# Altium schematic sheet cpu.SchDoc
size A3
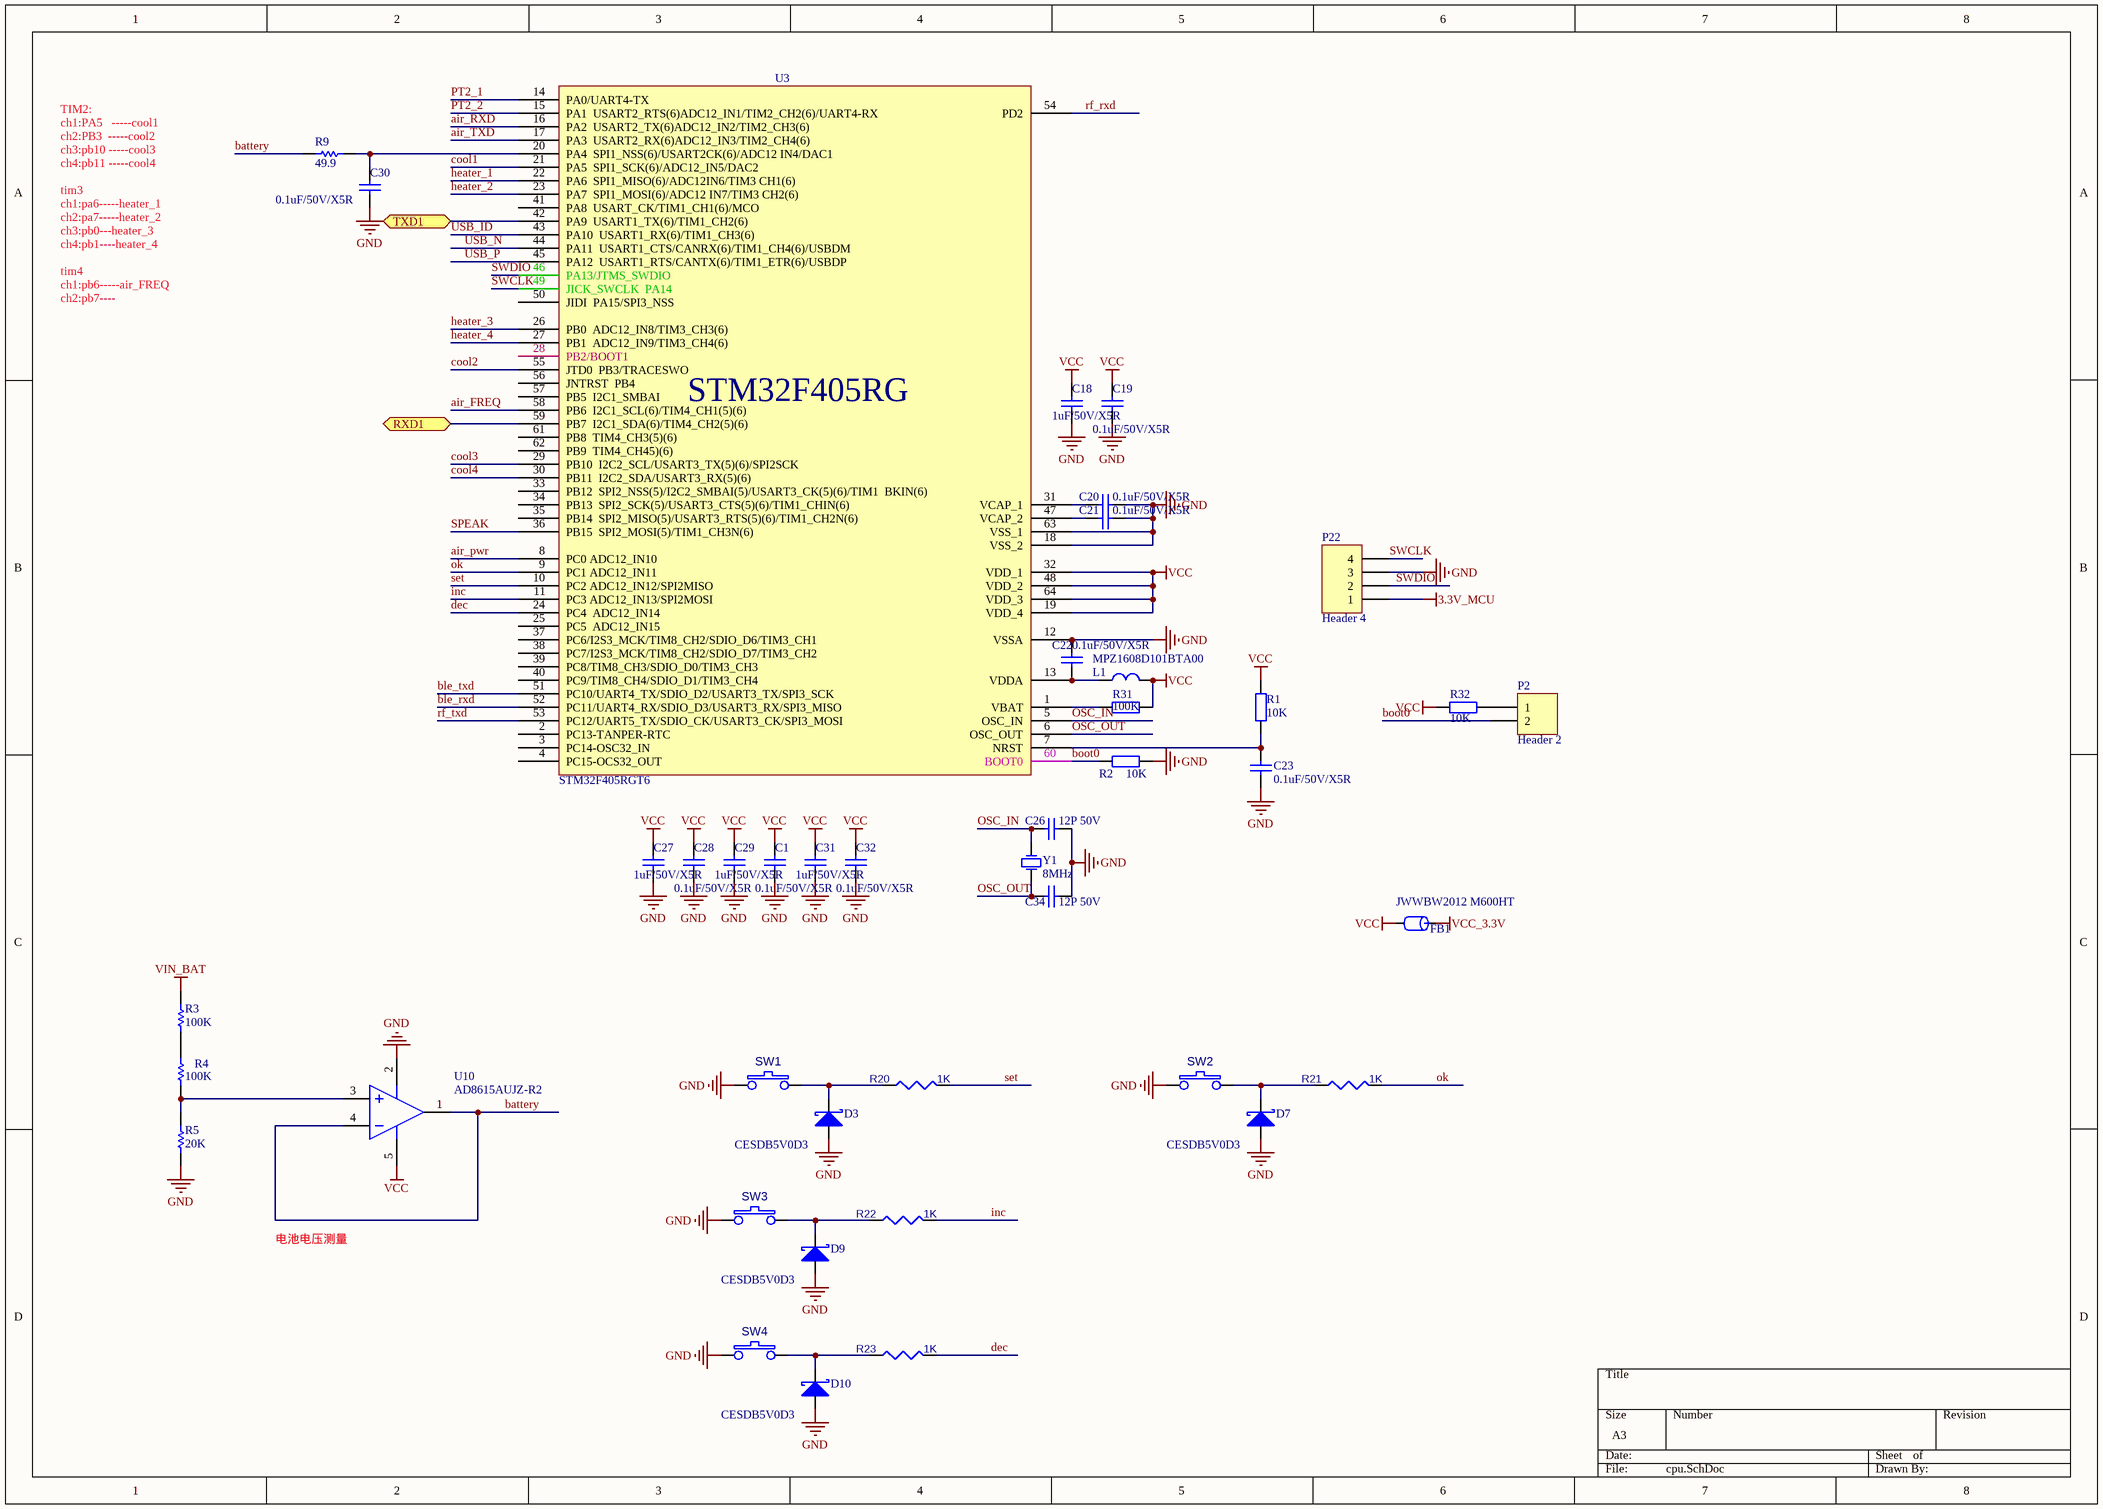
[diagram p0: cpu.SchDoc]

## Parts
C1  0.1uF/50V/X5R  [0603C]
C18  1uF/50V/X5R  [0603C]
C19  0.1uF/50V/X5R  [0603C]
C20  0.1uF/50V/X5R  [0603C]
C21  0.1uF/50V/X5R  [0603C]
C22  0.1uF/50V/X5R  [0603C]
C23  0.1uF/50V/X5R  [0603C]
C26  12P 50V  [0603C]
C27  1uF/50V/X5R  [0603C]
C28  0.1uF/50V/X5R  [0603C]
C29  1uF/50V/X5R  [0603C]
C30  0.1uF/50V/X5R  [0603C]
C31  1uF/50V/X5R  [0603C]
C32  0.1uF/50V/X5R  [0603C]
C34  12P 50V  [0603C]
D3  CESDB5V0D3  [SOD323]
D7  CESDB5V0D3  [SOD323]
D9  CESDB5V0D3  [SOD323]
D10  CESDB5V0D3  [SOD323]
FB1  JWWBW2012 M600HT  [0805CZ]
L1  MPZ1608D101BTA00  [0603R]
P2  Header 2  [HDR1X2]
P22  Header 4  [HDR1X4]
R1  10K  [0603R]
R2  10K  [0603R]
R3  100K  [0603R]
R4  100K  [0603R]
R5  20K  [0603R]
R9  49.9  [0603R]
R20  value 1K  [0603R]  (hidden comment: 1k/1%)
R21  value 1K  [0603R]  (hidden comment: 1k/1%)
R22  value 1K  [0603R]  (hidden comment: 1k/1%)
R23  value 1K  [0603R]  (hidden comment: 1k/1%)
R31  100K  [0603R]
R32  10K  [0603R]
SW1  SW PUSHBUTTON  [SW-SMD_L3.9-W3.0-P4.45]  (value not drawn)
SW2  SW PUSHBUTTON  [SW-SMD_L3.9-W3.0-P4.45]  (value not drawn)
SW3  SW PUSHBUTTON  [SW-SMD_L3.9-W3.0-P4.45]  (value not drawn)
SW4  SW PUSHBUTTON  [SW-SMD_L3.9-W3.0-P4.45]  (value not drawn)
U3  STM32F405RGT6  [LQFP-64]
U10  AD8615AUJZ-R2  [sot-23-5]
Y1  8MHz  [CRAY_5032]

## Ports
RXD1 (bidir), TXD1 (bidir)

## Nets
3.3V_MCU: P22.1
GND: C1.1 C18.1 C19.1 C20.1 C21.1 C22.1 C23.1 C26.1 C27.1 C28.1 C29.1 C30.1 C31.1 C32.1 C34.1 D3.1(A) D7.1(A) D9.1(A) D10.1(A) P22.3 R2.2 R5.2 SW1.1 SW2.1 SW3.1 SW4.1 U3.12(VSSA) U3.18(VSS_2) U3.63(VSS_1) U10.2(G)
VCC: C1.2 C18.2 C19.2 C27.2 C28.2 C29.2 C31.2 C32.2 FB1.2 L1.2 R1.1 R31.1 R32.2 U3.19(VDD_4) U3.32(VDD_1) U3.48(VDD_2) U3.64(VDD_3) U10.5(VCC)
VCC_3.3V: FB1.1
VIN_BAT: R3.1
air_FREQ: U3.58(PB6__I2C1_SCL(6)/TIM4_CH1(5)(6))
air_pwr: U3.8(PC0_ADC12_IN10)
air_RXD: U3.16(PA2__USART2_TX(6)ADC12_IN2/TIM2_CH3(6))
air_TXD: U3.17(PA3__USART2_RX(6)ADC12_IN3/TIM2_CH4(6))
battery: R9.1 U10.1(OS_NUL) U10.4(V-)
ble_rxd: U3.52(PC11/UART4_RX/SDIO_D3/USART3_RX/SPI3_MISO)
ble_txd: U3.51(PC10/UART4_TX/SDIO_D2/USART3_TX/SPI3_SCK)
boot0: P2.2 R2.1 U3.60(BOOT0)
cool1: U3.21(PA5__SPI1_SCK(6)/ADC12_IN5/DAC2)
cool2: U3.55(JTD0__PB3/TRACESWO)
cool3: U3.29(PB10__I2C2_SCL/USART3_TX(5)(6)/SPI2SCK)
cool4: U3.30(PB11__I2C2_SDA/USART3_RX(5)(6))
dec: R23.2 U3.24(PC4__ADC12_IN14)
heater_1: U3.22(PA6__SPI1_MISO(6)/ADC12IN6/TIM3_CH1(6))
heater_2: U3.23(PA7__SPI1_MOSI(6)/ADC12_IN7/TIM3_CH2(6))
heater_3: U3.26(PB0__ADC12_IN8/TIM3_CH3(6))
heater_4: U3.27(PB1__ADC12_IN9/TIM3_CH4(6))
inc: R22.2 U3.11(PC3_ADC12_IN13/SPI2MOSI)
ok: R21.2 U3.9(PC1_ADC12_IN11)
OSC_IN: C26.2 U3.5(OSC_IN) Y1.2(OSC2)
OSC_OUT: C34.2 U3.6(OSC_OUT) Y1.1(OSC1)
PT2_1: U3.14(PA0/UART4-TX)
PT2_2: U3.15(PA1__USART2_RTS(6)ADC12_IN1/TIM2_CH2(6)/UART4-RX)
rf_rxd: U3.54(PD2)
rf_txd: U3.53(PC12/UART5_TX/SDIO_CK/USART3_CK/SPI3_MOSI)
RXD1: U3.59(PB7__I2C1_SDA(6)/TIM4_CH2(5)(6)) ; port RXD1
set: R20.2 U3.10(PC2_ADC12_IN12/SPI2MISO)
SPEAK: U3.36(PB15__SPI2_MOSI(5)/TIM1_CH3N(6))
SWCLK: P22.4 U3.49(JICK_SWCLK__PA14)
SWDIO: P22.2 U3.46(PA13/JTMS_SWDIO)
TXD1: U3.42(PA9__USART1_TX(6)/TIM1_CH2(6)) ; port TXD1
USB_ID: U3.43(PA10__USART1_RX(6)/TIM1_CH3(6))
USB_N: U3.44(PA11__USART1_CTS/CANRX(6)/TIM1_CH4(6)/USBDM)
USB_P: U3.45(PA12__USART1_RTS/CANTX(6)/TIM1_ETR(6)/USBDP)
NetC20_2: C20.2 U3.31(VCAP_1)
NetC21_2: C21.2 U3.47(VCAP_2)
NetC22_2: C22.2 L1.1 U3.13(VDDA)
NetC23_2: C23.2 R1.2 U3.7(NRST)
NetC30_2: C30.2 R9.2 U3.20(PA4__SPI1_NSS(6)/USART2CK(6)/ADC12_IN4/DAC1)
NetD3_2: D3.2(K) R20.1 SW1.2
NetD7_2: D7.2(K) R21.1 SW2.2
NetD9_2: D9.2(K) R22.1 SW3.2
NetD10_2: D10.2(K) R23.1 SW4.2
NetP2_1: P2.1 R32.1
NetR3_2: R3.2 R4.1
NetR4_2: R4.2 R5.1 U10.3(V+)
NetR31_2: R31.2 U3.1(VBAT)

Not connected (* = marked no-connect by the designer): U3 2(PC13-TANPER-RTC) 3(PC14-OSC32_IN) 4(PC15-OCS32_OUT) 25(PC5__ADC12_IN15) 28(PB2/BOOT1) 33(PB12__SPI2_NSS(5)/I2C2_SMBAI(5)/USART3_CK(5)(6)/TIM1__BKIN(6)) 34(PB13__SPI2_SCK(5)/USART3_CTS(5)(6)/TIM1_CHIN(6)) 35(PB14__SPI2_MISO(5)/USART3_RTS(5)(6)/TIM1_CH2N(6)) 37(PC6/I2S3_MCK/TIM8_CH2/SDIO_D6/TIM3_CH1) 38(PC7/I2S3_MCK/TIM8_CH2/SDIO_D7/TIM3_CH2) 39(PC8/TIM8_CH3/SDIO_D0/TIM3_CH3) 40(PC9/TIM8_CH4/SDIO_D1/TIM3_CH4) 41(PA8__USART_CK/TIM1_CH1(6)/MCO) 50(JIDI__PA15/SPI3_NSS) 56(JNTRST__PB4) 57(PB5__I2C1_SMBAI) 61(PB8__TIM4_CH3(5)(6)) 62(PB9__TIM4_CH45)(6))

## Notes on the sheet
- TIM2:
  ch1:PA5   -----cool1
  ch2:PB3  -----cool2
  ch3:pb10 -----cool3
  ch4:pb11 -----cool4
  tim3
  ch1:pa6-----heater_1
  ch2:pa7-----heater_2
  ch3:pb0---heater_3
  ch4:pb1----heater_4
  tim4
  ch1:pb6-----air_FREQ
  ch2:pb7----
- 电池电压测量

## Library data of the parts
C1 C18-C23 C26-C32 C34 = CAP4: 贴片电容 20%
D3 D7 D9 D10 = DIODE S: Schottky Diode
FB1 = FB: Part Field 1: 磁珠/0603/1K ohm/100MHz; Text Field1: FB; Value: JWWBW2012 M600HT
L1 = CIZHU1: 磁珠电感 100R 100MHz
P2 = Header 2: Header, 2-Pin; LatestRevisionDate: 17-Jul-2002; LatestRevisionNote: Re-released for DXP Platform.; Publisher: Altium Limited
P22 = Header 4: Header, 4-Pin; LatestRevisionDate: 17-Jul-2002; LatestRevisionNote: Re-released for DXP Platform.; Publisher: Altium Limited
R1 R2 R31 R32 = RES2: 贴片电阻 5%
R3-R5 R9 = Res1: Resistor; Published: 8-Jun-2000; LatestRevisionDate: 17-Jul-2002; LatestRevisionNote: Re-released for DXP Platform.; PackageReference: AXIAL-0.3; Publisher: Altium Limited
R20-R23 = RESISTOR_0: Part Reference: R70; SIGNAL_MODEL: DEFAULT_RESISTOR_200OHM_1_2; PCB Footprint: R0402
SW1-SW4 = SW PUSHBUTTON: Part Reference: SW2; PCB Footprint: KEY_3X6; Value: SW PUSHBUTTON
U3 = STM32F405RG: MCU
U10 = AD8615
Y1 = XTAL: 晶振